# EasyEDA Pro project pcb easy eda pro stm32wb5mmg01 - Elektor.eprj, board PCB10
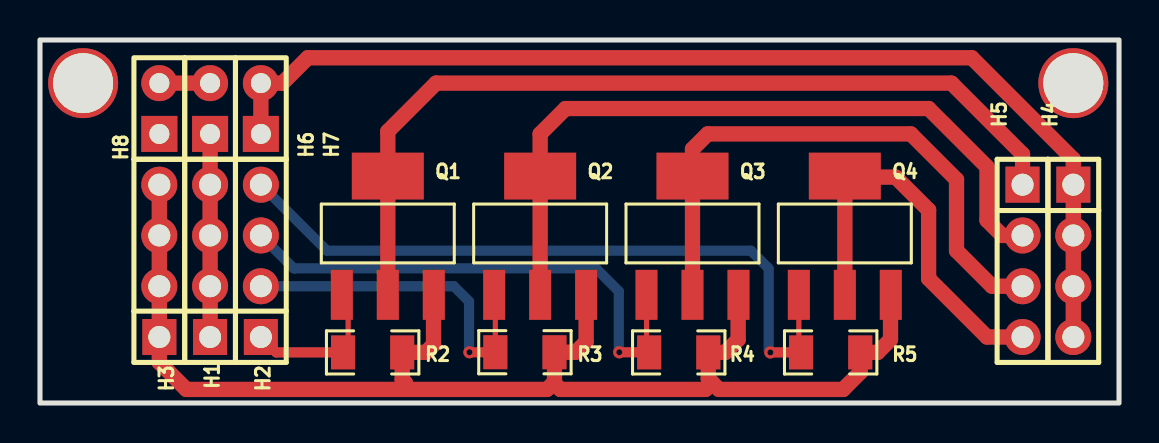
[diagram p9: board, top side]
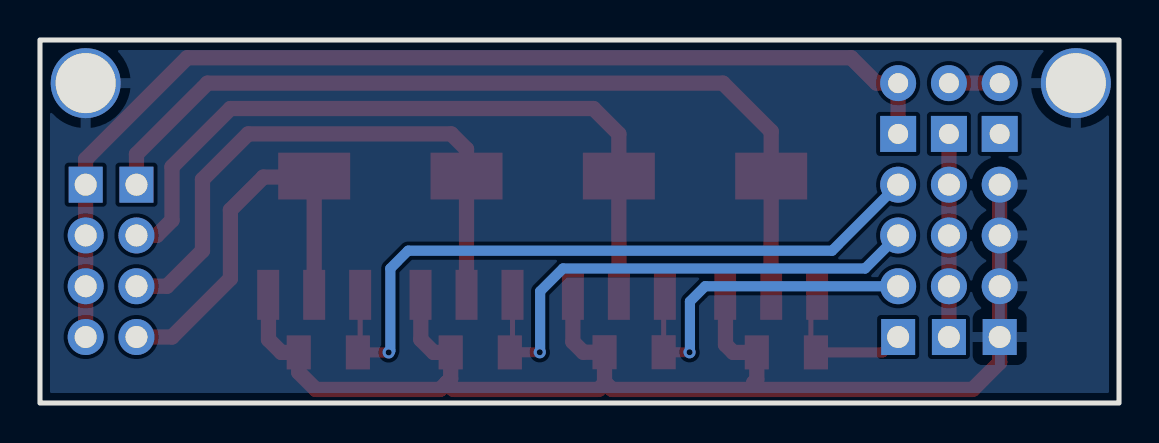
[diagram p10: board, bottom side, seen from below]

Outline 53.98 x 18.16 mm; copper layers: Top Layer, Bottom Layer. Coordinates in mm from the lower left corner of the outline.
Outline path: rectangle 0,18.16 53.98,0
Stack: Top Layer 0.035mm / Dielectric1 1.51mm FR4 er 4.5 / Bottom Layer 0.035mm

## Design rules (mm)
template: JLCPCB Capability(Two Layers Board)
spacing copperThickness1oz (default): track to track 0.102, other pairs 0.152 to 0.3
spacing copperThickness2oz: track to track 0.203, other pairs 0.152 to 0.3
track width copperThickness1oz (default): min 0.127, default 0.254, max 2.54
track width copperThickness2oz: min 0.203, default 0.254, max 2.54
differential pair differentialPair (default): width min 0.127, default 0.254, max 2.54; gap min 0.152, default 0.152
via viaSize (default): diameter min 0.5, default 0.61, max 10; hole min 0.3, default 0.305, max 6.3

## Placement (name value [footprint] x y rotation side)
H1  -  [hdr-th_4p-p2.54-v-m]  8.51 7.11 90 top
H2  -  [hdr-th_4p-p2.54-v-m]  11.05 7.11 90 top
H3  -  [hdr-th_4p-p2.54-v-m]  5.97 7.11 90 top
H4  -  [hdr-th_4p-p2.54-v-m]  51.69 7.11 270 top
H5  -  [hdr-th_4p-p2.54-v-m]  49.15 7.11 270 top
H6  -  [HDR-TH_2P-P2.54-V-M-1]  8.51 14.73 90 top
H7  -  [HDR-TH_2P-P2.54-V-M-1]  11.05 14.73 90 top
H8  -  [HDR-TH_2P-P2.54-V-M-1]  5.97 14.73 90 top
NOREF  -  [Pad_e433]  2.16 16 0 top
NOREF#2  -  [Pad_e337]  51.69 16 0 top
Q1  BUK98150-55A/CUF  [SOT-223-3_L6.5-W3.4-P2.30-LS7.0-BR]  17.4 8.38 270 top
Q2  BUK98150-55A/CUF  [SOT-223-3_L6.5-W3.4-P2.30-LS7.0-BR]  25.02 8.38 270 top
Q3  BUK98150-55A/CUF  [SOT-223-3_L6.5-W3.4-P2.30-LS7.0-BR]  32.64 8.38 270 top
Q4  BUK98150-55A/CUF  [SOT-223-3_L6.5-W3.4-P2.30-LS7.0-BR]  40.26 8.38 270 top
R2  10kΩ  [R1206]  16.64 2.53 180 top
R3  10kΩ  [R1206]  24.26 2.54 180 top
R4  10kΩ  [R1206]  31.95 2.53 180 top
R5  10kΩ  [R1206]  39.55 2.53 180 top

## Footprints (pads in the part's own frame, mm; a bottom-side part is the same pattern mirrored in y, then rotated)
HDR-TH_2P-P2.54-V-M-1
  rect 1.8x1.8 hole 1: 1(-1.27,0)
  round 1.8 hole 1: 2(1.27,0)
hdr-th_4p-p2.54-v-m
  rect 1.801x1.7 hole 1.1x1.001: 1(-3.81,0)
  round 1.801 hole 1.1x1.001: 2(-1.27,0) 3(1.27,0) 4(3.81,0)
Pad_e337
  round 3.5 hole 2.999: 5(0,0)
Pad_e433
  round 3.5 hole 2.999: 5(0,0)
R1206
  rect 1.208x1.701 smd: 1(-1.479,0) 2(1.479,0)
SOT-223-3_L6.5-W3.4-P2.30-LS7.0-BR
  rect 2.5x1.1 smd: 1(2.97,-2.3) 2(2.97,0) 3(2.97,2.3)
  rect 2.34x3.6 smd: 4(-2.97,0)

## Nets
As in the schematic, except:
GND: H3.1 H3.2 H3.3 H3.4 NOREF.5 NOREF#2.5 Q1.3 Q2.3 Q3.3 Q4.3 R2.1 R3.1 R4.1 R5.1

## Via types
v1: diameter 0.61, hole 0.305, Top Layer to Bottom Layer, 3 vias

## Routing (per net, layer and track width the routed paths; a pad name or vN(x,y) marks a point on that pad's centre or on a via; arc(x,y) is an arc through that point)
GND: length 67.9
  Top Layer w0.762: Q2.3 27.32,3.06 26.8,2.54 R3.1 25.74,1.02 25.7,1.02 ; Q4.3 42.55,5.4 42.55,3.18 41.9,2.53 R5.1 41.03,1.53 40.18,0.68 33.96,0.68 33.63,1.02 ; 18.27,0.68 18.27,1.02 18.12,1.17 R2.1 19.3,2.53 19.68,2.92 19.68,5.4 Q1.3 ; 18.27,0.68 7.32,0.68 5.97,2.03 H3.1 H3.2 H3.3 H3.4 ; 18.27,0.68 25.36,0.68 25.7,1.02 ; 33.63,1.02 33.29,0.68 26.03,0.68 25.7,1.02 ; 33.63,1.02 33.43,1.21 33.43,2.53 34.28,2.53 34.92,3.18 34.92,5.4 Q3.3
VBAT: length 10.2
  Top Layer w0.762: H6.1 H1.4 H1.3 H1.2 H1.1
VIN: length 54.7
  Top Layer w0.762: H4.4 H4.3 H4.2 H4.1 51.69,12.19 46.61,17.27 13.4,17.27 12.13,16 H7.2 H7.1
CMDLAMP: length 35.8
  Top Layer w0.254: R5.2 37.96,2.65 Q4.1
  Top Layer w0.508: v1(36.53,2.53) R5.2
  Bottom Layer w0.508: v1(36.53,2.53) 36.45,2.62 36.45,6.73 35.56,7.62 14.35,7.62 H2.4
CMDP1: length 7.4
  Top Layer w0.254: 15.42,2.53 15.42,5.1 Q1.1
  Top Layer w0.508: H2.1 11.82,2.53 R2.2
CMDP2: length 17.5
  Top Layer w0.254: R3.2 22.78,5.35 Q2.1
  Top Layer w0.508: v1(21.48,2.54) R3.2
  Bottom Layer w0.508: H2.2 20.7,5.84 21.46,5.08 21.46,2.56 v1(21.48,2.54)
CMDP3: length 26.5
  Top Layer w0.254: Q3.1 30.34,2.67 R4.2
  Top Layer w0.508: v1(28.98,2.54) 30.46,2.54
  Bottom Layer w0.508: H2.3 12.7,6.73 27.81,6.73 28.96,5.59 28.96,2.56 v1(28.98,2.54)
POWERLAMP: length 20.3
  Top Layer w0.254: Q4.4 40.26,10.92
  Top Layer w0.762: H5.4 47.37,3.3 44.45,6.22 44.45,9.65 42.8,11.3 40.64,11.3 40.26,10.92 Q4.2
POWERPUMP1: length 43.9
  Top Layer w0.762: H5.1 49.15,12.45 45.59,16 19.81,16 17.4,13.59 Q1.4 Q1.2
POWERPUMP2: length 36.9
  Top Layer w0.762: H5.2 48.13,8.38 47.37,9.14 47.37,11.81 44.45,14.73 26.29,14.73 25.02,13.46 Q2.4 Q2.2
POWERPUMP3: length 29.4
  Top Layer w0.762: H5.3 47.62,5.84 45.85,7.62 45.85,11.18 43.56,13.46 33.4,13.46 32.64,12.7 Q3.4 Q3.2
VEXT: length 2.5
  Top Layer w0.762: H8.2 H6.2

## Copper pours and planes (outline as drawn; the poured copper is in the pictures)
GND on Bottom Layer: 0,18.16 53.98,18.16 53.98,0 0,0

## Text on the board
Document Layer: 5V/ VEXT - VIN JUMPER / GND/VBAT - VIN JUMPER | GND/VBAT/CMDLAMP / GND/VBAT/CMDPUMP3 / GND/VBAT/CMDPUMP2 / GND/VBAT/CMDPUMP1 | POWERPUMP1/VIN / POWERPUMP2/VIN / POWERPUMP3/VIN / POWERLAMP/VIN
